# EAGLE design capelet_storage (EAGLE 9.5.2)
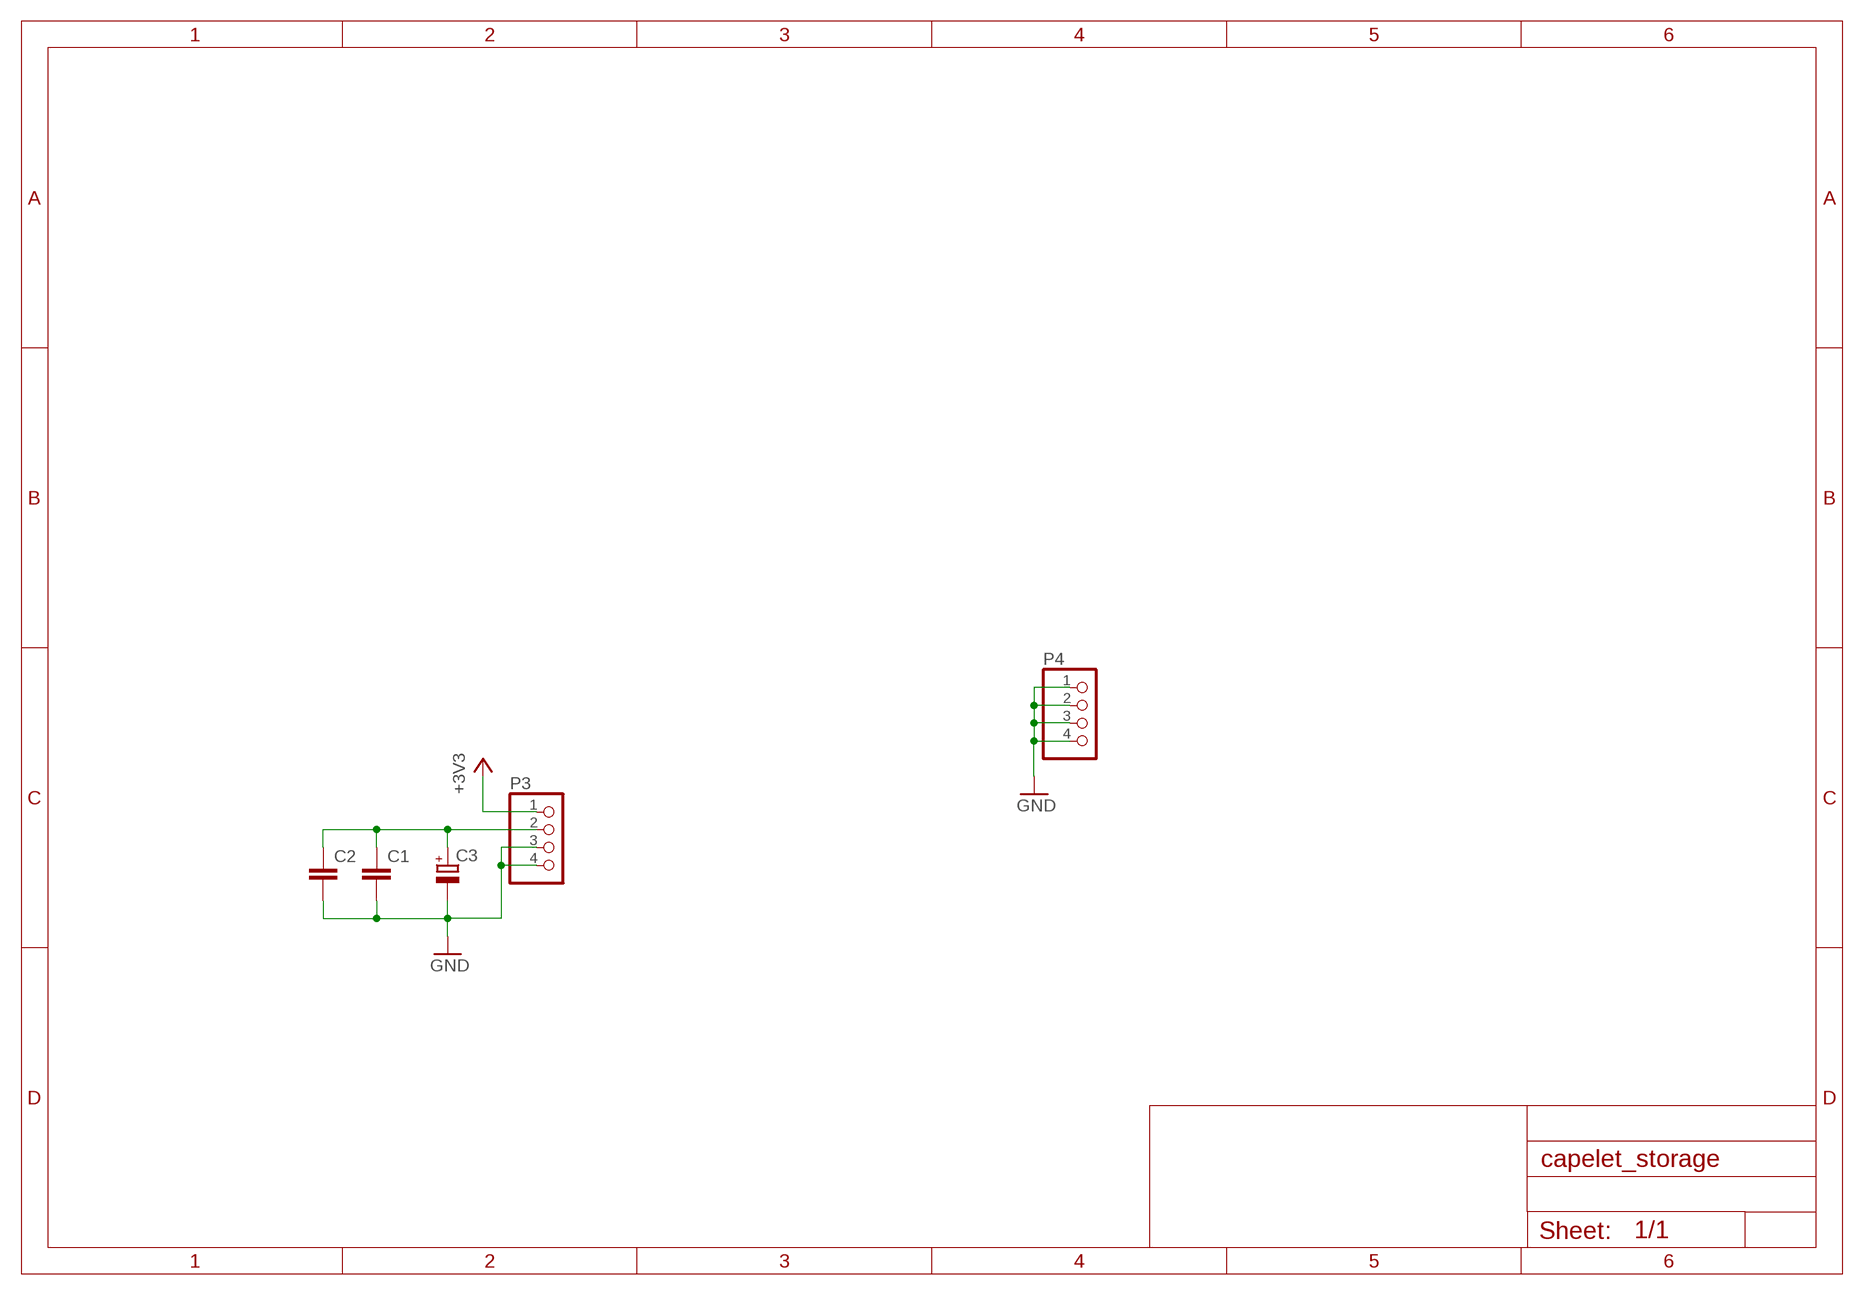
[diagram p0: schematic, sheet 1]

## Parts
C1  C_SMD0805  [CAPC2012X145]
C2  C_SMD1210  [CAPC3225X280]
C3  CPOL-EUE5-8.5  [E5-8,5]
P3  PINHD-1X4  [1X04]
P4  PINHD-1X4  [1X04]

## Nets
+3V3: P3.1
GND: C1.2 C2.2 C3.- P3.3 P3.4 P4.1 P4.2 P4.3 P4.4
N$1: C1.1 C2.1 C3.+ P3.2

## Library data of the parts
C1 C2 = shepherd:C_SMD
C3 = rcl:CPOL-EU: POLARIZED CAPACITOR, European symbol; SPICEPREFIX: C
P3 P4 = pinhead:PINHD-1X4: PIN HEADER

## Board
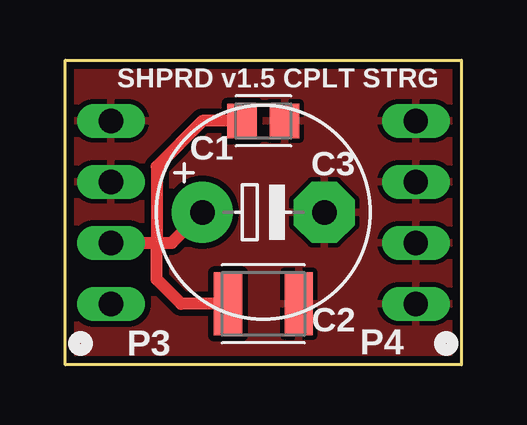
[diagram p1: board, top side]
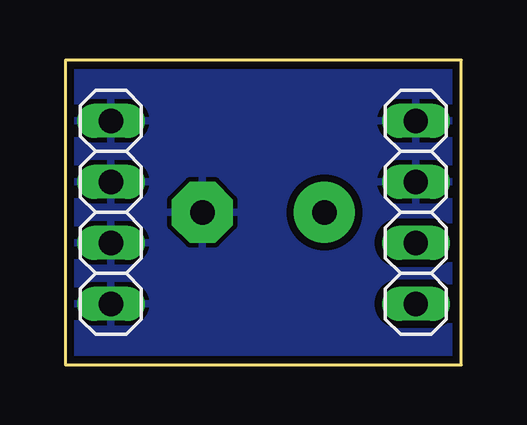
[diagram p2: board, bottom side, seen from below]

Size 16.51 x 12.7 mm. Coordinates in mm from the lower left corner, seen from the top.
Copper layers (1*16): Top 0.035mm / dielectric 1.5mm / Bottom 0.035mm
Design rules "PCB-POOL Standard": minimum track width 0.15mm, minimum drill 0.3mm, track to track 0.15mm, track to pad 0.15mm, pad to pad 0.15mm, via to via 0.15mm, smd to smd 0.15mm, copper to edge 0.3mm, drill to drill 0.2mm, minimum pad ring 0.2mm, minimum via ring 0.15mm, stop-mask expansion 0.03mm, vias tented up to drill 0mil, thermal gap 0.2mm

### Footprints (pad centres in the part's own frame; a part is rotated, then mirrored left to right if it is on the bottom)
CAPC2012X145 = smd 1.234 x 1.453: 1 -0.884,0; 2 0.884,0
CAPC3225X280 = smd 1.178 x 2.625: 1 -1.477,0; 2 1.477,0
E5-8,5 = drill 1.016 pad 2.54: + -2.54,0 | drill 1.016 pad 2.54 octagon: - 2.54,0
1X04 = drill 1.016 long: 1 -3.81,0; 2 -1.27,0; 3 1.27,0; 4 3.81,0

### Placement (x,y rotation side)
C1  8.26,10.16 0 top
C2  8.26,2.54 0 top
C3  8.26,6.35 0 top
P3  1.91,6.35 90 bottom
P4  14.61,6.35 90 bottom
U$1  [SHPRD_CPLT_S]  -0.64,0 0 top

### Tracks (layer width: path | path; a pad name or v marks a point on that pad's centre or on a via)
GND
  pour Bottom (isolate 0.305): 0,12.7 16.51,12.7 16.51,0 0,0
  pour Top (isolate 0.254): 0,12.7 16.51,12.7 16.51,0 0,0
N$1
  Top 0.508: P3.2 3.81,5.08 | 3.81,5.08 4.45,5.08 C3.+ | C1.1 5.71,10.16 3.81,8.26 3.81,5.08 | C2.1 4.83,2.54 3.81,3.56 3.81,5.08

### Text on the board
tNames: SHPRD v1.5 CPLT STRG
Document: P3: Pins pointing / to bottom, / solder on top | P4: Pins pointing / to bottom, / solder on top